# EAGLE design LPRD Sensors 1.4 (EAGLE 8.6.0)

## Sheet 1 of 2: Main This sheet contains the Arduino Mega pin layout and status LEDs. A list of the pins used on the Arduino for programmer's reference: Accelerometer: D20 (SDA), D21 (SCL) Thermocouple 1: D28 (THERMO1_LED), D22 (MAXCS1) Thermocouple 2: D30 (THERMO2_LED), D33 (MAXCS2) Thermocouple 3: D32 (THERMO3_LED), D31 (MAXCS3) All Thermocouples: D24 (MAXDO), D52 (MAXCLK) Load Cell: D34 (FORCE_LED), D2 (FORCE_DAT), D26 (FORCE_CLK) Pressure 1: D36 (PRESSURE1_LED), A2 (VOUT_PRESSURE_1) Pressure 2: D50 (PRESSURE2_LED), A3 (VOUT_PRESSURE_2) Analog Temp Sensor 1: D46 (TEMP1_LED), A4 (VOUT_TEMPERATURE_1) Analog Temp Sensor 2: D48 (TEMP2_LED), A5 (VOUT_TEMPERATURE_2) LEDs: D42 (STATE_LED), D44 (STATUS_LED)
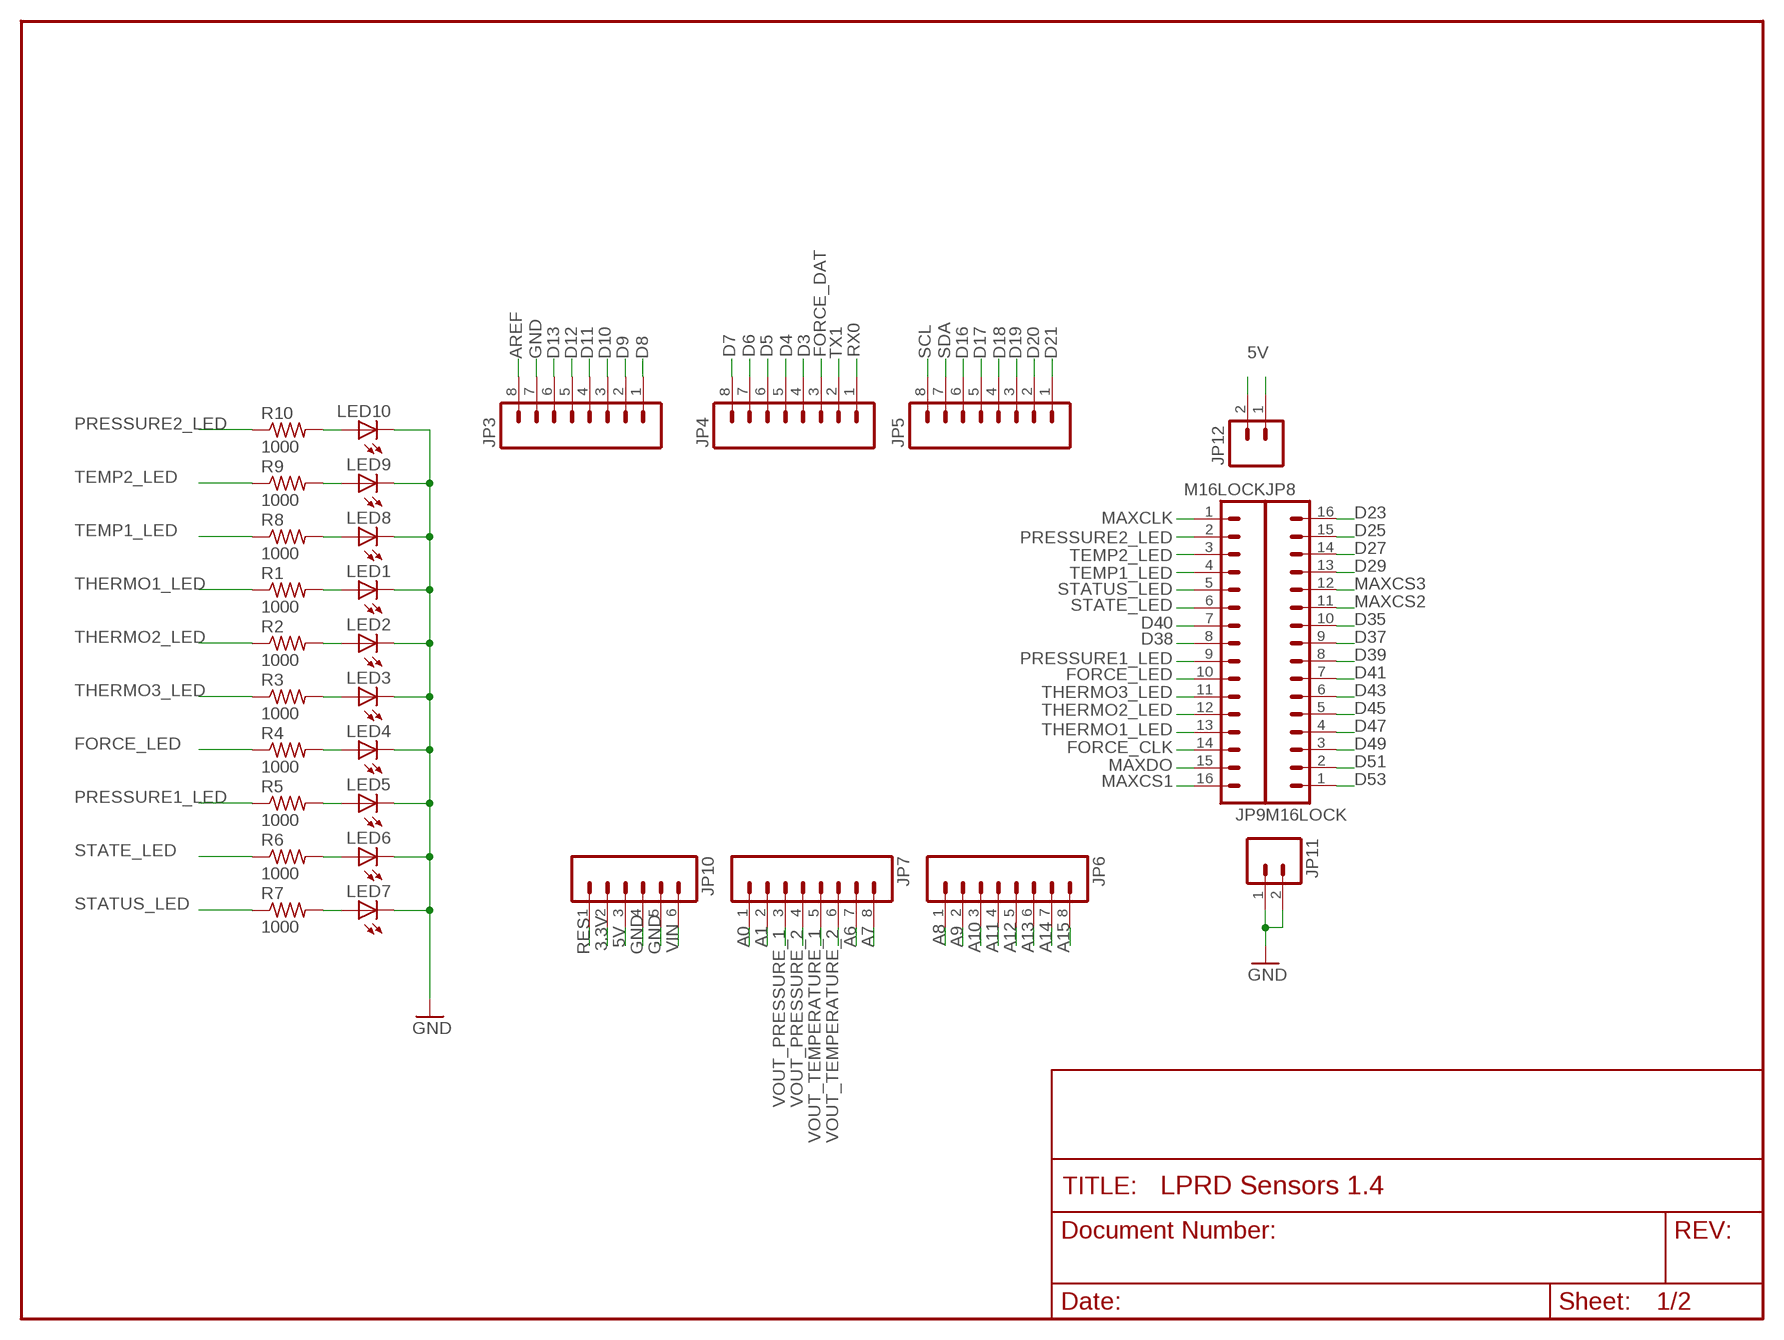
[diagram p0: schematic, sheet 1]

### Parts
JP3  M08LOCK  [1X08_LOCK]
JP4  M08LOCK  [1X08_LOCK]
JP5  M08LOCK  [1X08_LOCK]
JP6  M08LOCK  [1X08_LOCK]
JP7  M08LOCK  [1X08_LOCK]
JP8  M16LOCK  [1X16_LOCK]
JP9  M16LOCK  [1X16_LOCK]
JP10  M06LOCK  [1X06_LOCK]
JP11  M02LOCK  [1X02_LOCK]
JP12  M02LOCK  [1X02_LOCK]
LED1  LEDCHIP-LED0805  [CHIP-LED0805]
LED2  LEDCHIP-LED0805  [CHIP-LED0805]
LED3  LEDCHIP-LED0805  [CHIP-LED0805]
LED4  LEDCHIP-LED0805  [CHIP-LED0805]
LED5  LEDCHIP-LED0805  [CHIP-LED0805]
LED6  LEDCHIP-LED0805  [CHIP-LED0805]
LED7  LEDCHIP-LED0805  [CHIP-LED0805]
LED8  LEDCHIP-LED0805  [CHIP-LED0805]
LED9  LEDCHIP-LED0805  [CHIP-LED0805]
LED10  LEDCHIP-LED0805  [CHIP-LED0805]
R1  1000  R-US_R0805  [R0805]
R2  1000  R-US_R0805  [R0805]
R3  1000  R-US_R0805  [R0805]
R4  1000  R-US_R0805  [R0805]
R5  1000  R-US_R0805  [R0805]
R6  1000  R-US_R0805  [R0805]
R7  1000  R-US_R0805  [R0805]
R8  1000  R-US_R0805  [R0805]
R9  1000  R-US_R0805  [R0805]
R10  1000  R-US_R0805  [R0805]

### Nets
3.3V: JP10.2 ; also sheet 2
5V: JP10.3 JP12.1 JP12.2 ; also sheet 2
A0: JP7.1
A1: JP7.2
A6: JP7.7
A7: JP7.8
A8: JP6.1
A9: JP6.2
A10: JP6.3
A11: JP6.4
A12: JP6.5
A13: JP6.6
A14: JP6.7
A15: JP6.8
AREF: JP3.8
D3: JP4.4
D4: JP4.5
D5: JP4.6
D6: JP4.7
D7: JP4.8
D8: JP3.1
D9: JP3.2
D10: JP3.3
D11: JP3.4
D12: JP3.5
D13: JP3.6
D16: JP5.6
D17: JP5.5
D18: JP5.4
D19: JP5.3
D20: JP5.2
D21: JP5.1
D23: JP8.16
D25: JP8.15
D27: JP8.14
D29: JP8.13
D35: JP8.10
D37: JP8.9
D38: JP9.8
D39: JP8.8
D40: JP9.7
D41: JP8.7
D43: JP8.6
D45: JP8.5
D47: JP8.4
D49: JP8.3
D51: JP8.2
D53: JP8.1
FORCE_CLK: JP9.14 ; also sheet 2
FORCE_DAT: JP4.3 ; also sheet 2
FORCE_LED: JP9.10 R4.1
GND: JP3.7 JP10.4 JP10.5 JP11.1 JP11.2 LED1.C LED2.C LED3.C LED4.C LED5.C LED6.C LED7.C LED8.C LED9.C LED10.C ; also sheet 2
MAXCLK: JP9.1 ; also sheet 2
MAXCS1: JP9.16 ; also sheet 2
MAXCS2: JP8.11 ; also sheet 2
MAXCS3: JP8.12 ; also sheet 2
MAXDO: JP9.15 ; also sheet 2
N$1: LED1.A R1.2
N$2: LED2.A R2.2
N$3: LED3.A R3.2
N$4: LED4.A R4.2
N$5: LED5.A R5.2
N$6: LED6.A R6.2
N$7: LED7.A R7.2
N$15: LED8.A R8.2
N$16: LED9.A R9.2
N$23: LED10.A R10.2
PRESSURE1_LED: JP9.9 R5.1
PRESSURE2_LED: JP9.2 R10.1
RES: JP10.1
RX0: JP4.1
SCL: JP5.8 ; also sheet 2
SDA: JP5.7 ; also sheet 2
STATE_LED: JP9.6 R6.1
STATUS_LED: JP9.5 R7.1
TEMP1_LED: JP9.4 R8.1
TEMP2_LED: JP9.3 R9.1
THERMO1_LED: JP9.13 R1.1
THERMO2_LED: JP9.12 R2.1
THERMO3_LED: JP9.11 R3.1
TX1: JP4.2
VIN: JP10.6
VOUT_PRESSURE_1: JP7.3 ; also sheet 2
VOUT_PRESSURE_2: JP7.4 ; also sheet 2
VOUT_TEMPERATURE_1: JP7.5 ; also sheet 2
VOUT_TEMPERATURE_2: JP7.6 ; also sheet 2

## Sheet 2 of 2: Sensors This sheet contains the following sensor elements J1: MMA8451 accelerometer female 8-pin connector J5 & J11: PS-AN2 ASIC pressure sensor 3-pin screw connector J3 & J4: HX711 load cell 5-pin female connector J10: 4-pin screw connector for load cell wires J7, J8 & J9: K-Type Thermocouple 2-pin screw connector IC1, IC2 & IC3: MAX31855 thermocouple amplifier surface mounts J2: LM35DXB temperature sensor 4 pin connector
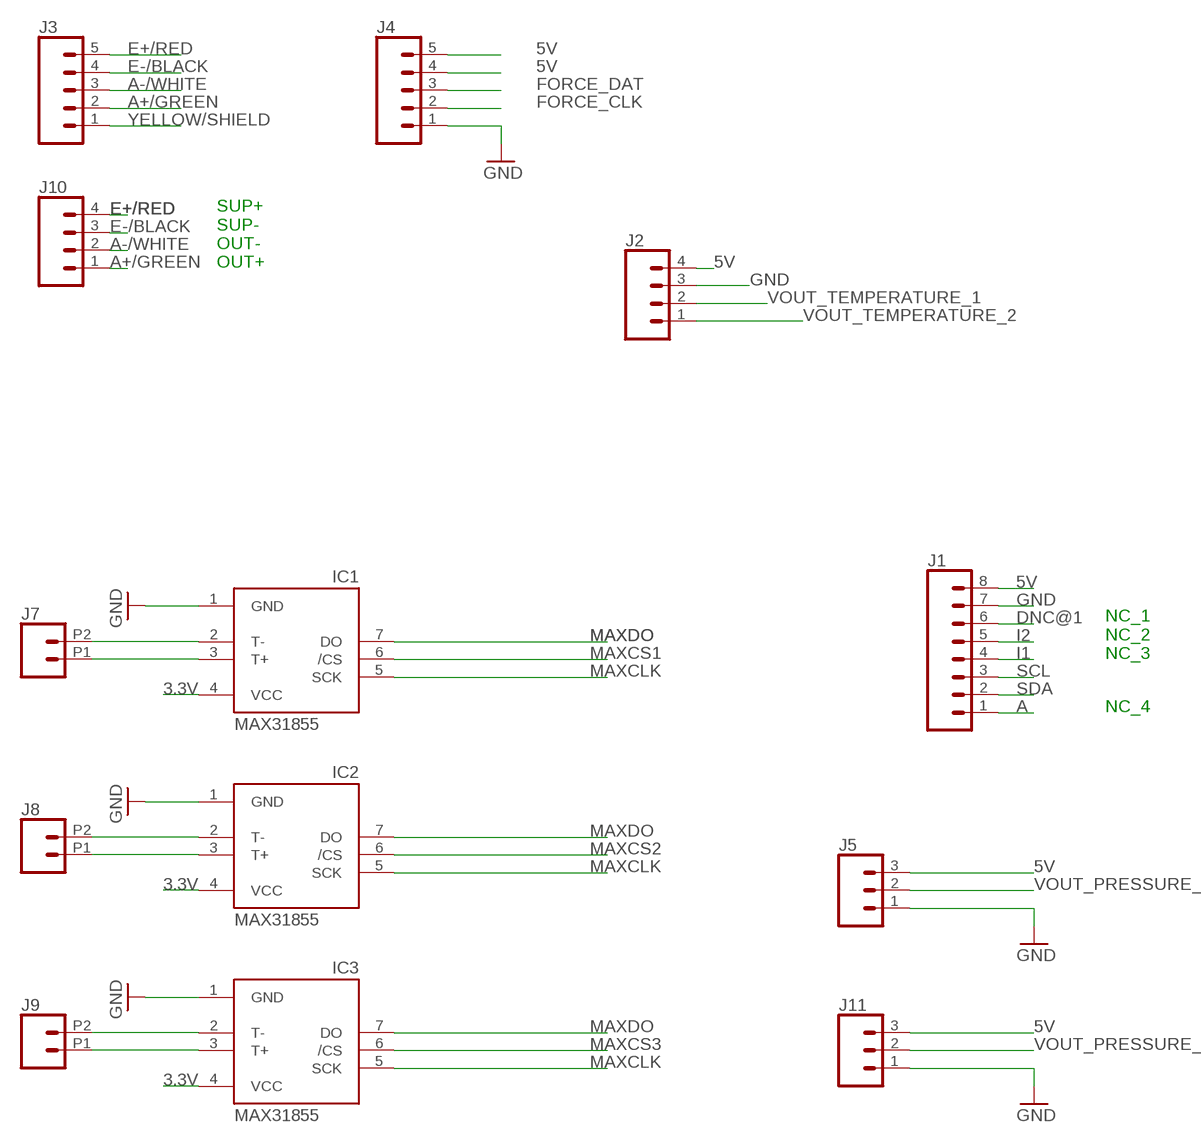
[diagram p1: schematic, sheet 2]

### Parts
IC1  MAX31855  MAX6675  [SO08]
IC2  MAX31855  MAX6675  [SO08]
IC3  MAX31855  MAX6675  [SO08]
J1  CONN_08"  [1X08]
J2  CONN_04  [1X04]
J3  CONN_05  [1X05]
J4  CONN_05  [1X05]
J5  CONN_03-SCREW-5MM  [SCREWTERMINAL-5MM-3]
J7  CONN_022.54MM_SCREWTERM  [1X02_2.54_SCREWTERM]
J8  CONN_022.54MM_SCREWTERM  [1X02_2.54_SCREWTERM]
J9  CONN_022.54MM_SCREWTERM  [1X02_2.54_SCREWTERM]
J10  CONN_04SCREW  [SCREWTERMINAL-3.5MM-4]
J11  CONN_03-SCREW-5MM  [SCREWTERMINAL-5MM-3]

### Nets
3.3V: IC1.4(VCC) IC2.4(VCC) IC3.4(VCC) ; also sheet 1
5V: J1.8 J2.4 J4.4 J4.5 J5.3 J11.3 ; also sheet 1
A: J1.1
A+/GREEN: J3.2 J10.1
A-/WHITE: J3.3 J10.2
DNC@1: J1.6
E+/RED: J3.5 J10.4
E-/BLACK: J3.4 J10.3
FORCE_CLK: J4.2 ; also sheet 1
FORCE_DAT: J4.3 ; also sheet 1
GND: IC1.1(GND) IC2.1(GND) IC3.1(GND) J1.7 J2.3 J4.1 J5.1 J11.1 ; also sheet 1
I1: J1.4
I2: J1.5
MAXCLK: IC1.5(SCK) IC2.5(SCK) IC3.5(SCK) ; also sheet 1
MAXCS1: IC1.6(/CS) ; also sheet 1
MAXCS2: IC2.6(/CS) ; also sheet 1
MAXCS3: IC3.6(/CS) ; also sheet 1
MAXDO: IC1.7(DO) IC2.7(DO) IC3.7(DO) ; also sheet 1
N$8: IC1.2(T-) J7.P2
N$10: IC1.3(T+) J7.P1
N$11: IC2.2(T-) J8.P2
N$12: IC2.3(T+) J8.P1
N$13: IC3.2(T-) J9.P2
N$14: IC3.3(T+) J9.P1
SCL: J1.3 ; also sheet 1
SDA: J1.2 ; also sheet 1
VOUT_PRESSURE_1: J5.2 ; also sheet 1
VOUT_PRESSURE_2: J11.2 ; also sheet 1
VOUT_TEMPERATURE_1: J2.2 ; also sheet 1
VOUT_TEMPERATURE_2: J2.1 ; also sheet 1
YELLOW/SHIELD: J3.1

### Notes on the sheet
- SUP+
  SUP-
  OUT-
  OUT+
- NC_1
  NC_2
  NC_3
- NC_4

## Library data of the parts
IC1-IC3 = adafruit:MAX6675
J1 = SparkFun-Connectors:CONN_08: Multi connection point. Often used as Generic Header-pin footprint for 0.1 inch spaced/style header connections On any of the 0.1 inch spaced packages, you can populate with these: Break Away Headers - Straight <https://www.sparkfun.com/products/116> (PRT-00116) Break Away Male Headers - Right Angle <https://www.sparkfun.com/products/553> (PRT-00553) Female Headers <https://www.sparkfun.com/products/115> (PRT-00115) Break Away Headers - Machine Pin <https://www.sparkfun.com/products/117> (PRT-00117) Break Away Female Headers - Swiss Machine Pin <https://www.sparkfun.com/products/743> (PRT-00743) Arduino Stackable Header - 8 Pin <https://www.sparkfun.com/products/9279> (PRT-09279) For SCREWTERMINALS and SPRING TERMINALS visit here: Screw Terimnals on SparkFun.com <https://www.sparkfun.com/search/results?term=Screw+Terminals> (5mm/3.5mm/2.54mm spacing) This device is also useful as a general connection point to wire up your design to another part of your project. Our various solder wires solder well into these plated through hole pads. Hook-Up Wire - Assortment (Stranded, 22 AWG) <https://www.sparkfun.com/products/11375> (PRT-11375) Hook-Up Wire - Assortment (Solid Core, 22 AWG) <https://www.sparkfun.com/products/11367> (PRT-11367) View the entire wire category on our website here <https://www.sparkfun.com/categories/141> Special notes: Molex polarized connector foot print use with SKU : PRT-08231 with associated crimp pins and housings. 1MM SMD Version SKU: PRT-10208 NOTES ON THE VARIANTS LOCK and LOCK_LONGPADS... This footprint was designed to help hold the alignment of a through-hole component (i.e. 6-pin header) while soldering it into place. You may notice that each hole has been shifted either up or down by 0.005 of an inch from it's more standard position (which is a perfectly straight line). This slight alteration caused the pins (the squares in the middle) to touch the edges of the holes. Because they are alternating, it causes a "brace" to hold the component in place. 0.005 has proven to be the perfect amount of "off-center" position when using our standard breakaway headers. Although looks a little odd when you look at the bare footprint, once you have a header in there, the alteration is very hard to notice. Also,if you push a header all the way into place, it is covered up entirely on the bottom side.; PROD_ID: CONN-08438
J2 = SparkFun-Connectors:CONN_04: Multi connection point. Often used as Generic Header-pin footprint for 0.1 inch spaced/style header connections On any of the 0.1 inch spaced packages, you can populate with these: Break Away Headers - Straight <https://www.sparkfun.com/products/116> (PRT-00116) Break Away Male Headers - Right Angle <https://www.sparkfun.com/products/553> (PRT-00553) Female Headers <https://www.sparkfun.com/products/115> (PRT-00115) Break Away Headers - Machine Pin <https://www.sparkfun.com/products/117> (PRT-00117) Break Away Female Headers - Swiss Machine Pin <https://www.sparkfun.com/products/743> (PRT-00743) For SCREWTERMINALS and SPRING TERMINALS visit here: Screw Terimnals on SparkFun.com <https://www.sparkfun.com/search/results?term=Screw+Terminals> (5mm/3.5mm/2.54mm spacing) This device is also useful as a general connection point to wire up your design to another part of your project. Our various solder wires solder well into these plated through hole pads. Hook-Up Wire - Assortment (Stranded, 22 AWG) <https://www.sparkfun.com/products/11375> (PRT-11375) Hook-Up Wire - Assortment (Solid Core, 22 AWG) <https://www.sparkfun.com/products/11367> (PRT-11367) View the entire wire category on our website here <https://www.sparkfun.com/categories/141> Special notes: Molex polarized connector foot print use with SKU : PRT-08231 with associated crimp pins and housings. 1MM SMD Version SKU: PRT-10208; PROD_ID: CONN-09696
J3 J4 = SparkFun-Connectors:CONN_05: Multi connection point. Often used as Generic Header-pin footprint for 0.1 inch spaced/style header connections On any of the 0.1 inch spaced packages, you can populate with these: Break Away Headers - Straight <https://www.sparkfun.com/products/116> (PRT-00116) Break Away Male Headers - Right Angle <https://www.sparkfun.com/products/553> (PRT-00553) Female Headers <https://www.sparkfun.com/products/115> (PRT-00115) Break Away Headers - Machine Pin <https://www.sparkfun.com/products/117> (PRT-00117) Break Away Female Headers - Swiss Machine Pin <https://www.sparkfun.com/products/743> (PRT-00743) For SCREWTERMINALS and SPRING TERMINALS visit here: Screw Terimnals on SparkFun.com <https://www.sparkfun.com/search/results?term=Screw+Terminals> (5mm/3.5mm/2.54mm spacing) This device is also useful as a general connection point to wire up your design to another part of your project. Our various solder wires solder well into these plated through hole pads. Hook-Up Wire - Assortment (Stranded, 22 AWG) <https://www.sparkfun.com/products/11375> (PRT-11375) Hook-Up Wire - Assortment (Solid Core, 22 AWG) <https://www.sparkfun.com/products/11367> (PRT-11367) View the entire wire category on our website here <https://www.sparkfun.com/categories/141> Special notes: Molex polarized connector foot print use with SKU : PRT-08231 with associated crimp pins and housings. 1MM SMD Version SKU: PRT-10208
J5 J11 = SparkFun-Connectors:CONN_03: Multi connection point. Often used as Generic Header-pin footprint for 0.1 inch spaced/style header connections On any of the 0.1 inch spaced packages, you can populate with these: Break Away Headers - Straight <https://www.sparkfun.com/products/116> (PRT-00116) Break Away Male Headers - Right Angle <https://www.sparkfun.com/products/553> (PRT-00553) Female Headers <https://www.sparkfun.com/products/115> (PRT-00115) Break Away Headers - Machine Pin <https://www.sparkfun.com/products/117> (PRT-00117) Break Away Female Headers - Swiss Machine Pin <https://www.sparkfun.com/products/743> (PRT-00743) Stackable Header - 3 Pin (Female, 0.1") <https://www.sparkfun.com/products/13875> (PRT-13875) For SCREWTERMINALS and SPRING TERMINALS visit here: Screw Terimnals on SparkFun.com <https://www.sparkfun.com/search/results?term=Screw+Terminals> (5mm/3.5mm/2.54mm spacing) This device is also useful as a general connection point to wire up your design to another part of your project. Our various solder wires solder well into these plated through hole pads. Hook-Up Wire - Assortment (Stranded, 22 AWG) <https://www.sparkfun.com/products/11375> (PRT-11375) Hook-Up Wire - Assortment (Solid Core, 22 AWG) <https://www.sparkfun.com/products/11367> (PRT-11367) View the entire wire category on our website here <https://www.sparkfun.com/categories/141> Special notes: Molex polarized connector foot print use with SKU : PRT-08232 with associated crimp pins and housings.; PROD_ID: CONN-10134; SF_SKU: PRT-08433
J7-J9 = SparkFun-Connectors:CONN_02: Multi connection point. Often used as Generic Header-pin footprint for 0.1 inch spaced/style header connections On any of the 0.1 inch spaced packages, you can populate with these: Break Away Headers - Straight <https://www.sparkfun.com/products/116> (PRT-00116) Break Away Male Headers - Right Angle <https://www.sparkfun.com/products/553> (PRT-00553) Female Headers <https://www.sparkfun.com/products/115> (PRT-00115) Break Away Headers - Machine Pin <https://www.sparkfun.com/products/117> (PRT-00117) Break Away Female Headers - Swiss Machine Pin <https://www.sparkfun.com/products/743> (PRT-00743) For SCREWTERMINALS and SPRING TERMINALS visit here: Screw Terimnals on SparkFun.com <https://www.sparkfun.com/search/results?term=Screw+Terminals> (5mm/3.5mm/2.54mm spacing) This device is also useful as a general connection point to wire up your design to another part of your project. Our various solder wires solder well into these plated through hole pads. Hook-Up Wire - Assortment (Stranded, 22 AWG) <https://www.sparkfun.com/products/11375> (PRT-11375) Hook-Up Wire - Assortment (Solid Core, 22 AWG) <https://www.sparkfun.com/products/11367> (PRT-11367) View the entire wire category on our website here <https://www.sparkfun.com/categories/141> Special notes: Molex polarized connector foot print use with: PRT-08233 with associated crimp pins and housings. 2.54_SCREWTERM for use with PRT-10571. 3.5mm Screw Terminal footprints for PRT-08084 5mm Screw Terminal footprints for use with PRT-08432
J10 = SparkFun-Connectors:CONN_04: Multi connection point. Often used as Generic Header-pin footprint for 0.1 inch spaced/style header connections On any of the 0.1 inch spaced packages, you can populate with these: Break Away Headers - Straight <https://www.sparkfun.com/products/116> (PRT-00116) Break Away Male Headers - Right Angle <https://www.sparkfun.com/products/553> (PRT-00553) Female Headers <https://www.sparkfun.com/products/115> (PRT-00115) Break Away Headers - Machine Pin <https://www.sparkfun.com/products/117> (PRT-00117) Break Away Female Headers - Swiss Machine Pin <https://www.sparkfun.com/products/743> (PRT-00743) For SCREWTERMINALS and SPRING TERMINALS visit here: Screw Terimnals on SparkFun.com <https://www.sparkfun.com/search/results?term=Screw+Terminals> (5mm/3.5mm/2.54mm spacing) This device is also useful as a general connection point to wire up your design to another part of your project. Our various solder wires solder well into these plated through hole pads. Hook-Up Wire - Assortment (Stranded, 22 AWG) <https://www.sparkfun.com/products/11375> (PRT-11375) Hook-Up Wire - Assortment (Solid Core, 22 AWG) <https://www.sparkfun.com/products/11367> (PRT-11367) View the entire wire category on our website here <https://www.sparkfun.com/categories/141> Special notes: Molex polarized connector foot print use with SKU : PRT-08231 with associated crimp pins and housings. 1MM SMD Version SKU: PRT-10208; PROD_ID: 2xCONN-08399; SF_ID: 2xPRT-08084
JP3-JP7 = SparkFun:M08: Header 8 Standard 8-pin 0.1" header. Use with straight break away headers (SKU : PRT-00116), right angle break away headers (PRT-00553), swiss pins (PRT-00743), machine pins (PRT-00117), and female headers (PRT-00115).
JP8 JP9 = SparkFun:M16
JP10 = SparkFun:M06: Header 6 Standard 6-pin 0.1" header. Use with straight break away headers (SKU : PRT-00116), right angle break away headers (PRT-00553), swiss pins (PRT-00743), machine pins (PRT-00117), and female headers (PRT-00115). Molex polarized connector foot print use with SKU : PRT-08094 with associated crimp pins and housings. NOTES ON THE VARIANTS LOCK and LOCK_LONGPADS... This footprint was designed to help hold the alignment of a through-hole component (i.e. 6-pin header) while soldering it into place. You may notice that each hole has been shifted either up or down by 0.005 of an inch from it's more standard position (which is a perfectly straight line). This slight alteration caused the pins (the squares in the middle) to touch the edges of the holes. Because they are alternating, it causes a "brace" to hold the component in place. 0.005 has proven to be the perfect amount of "off-center" position when using our standard breakaway headers. Although looks a little odd when you look at the bare footprint, once you have a header in there, the alteration is very hard to notice. Also, if you push a header all the way into place, it is covered up entirely on the bottom side. This idea of altering the position of holes to aid alignment will be further integrated into the Sparkfun Library for other footprints. It can help hold any component with 3 or more connection pins.
JP11 JP12 = SparkFun:M02: Header 2 Standard 2-pin 0.1" header. Use with straight break away headers (SKU : PRT-00116), right angle break away headers (PRT-00553), swiss pins (PRT-00743), machine pins (PRT-00117), and female headers (PRT-00115). Molex polarized connector foot print use with SKU : PRT-08233 with associated crimp pins and housings.
LED1-LED10 = adafruit:LED: LED OSRAM: - CHIPLED LG R971, LG N971, LY N971, LG Q971, LY Q971, LO R971, LY R971 LH N974, LH R974 LS Q976, LO Q976, LY Q976 LO Q996 - Hyper CHIPLED LW Q18S LB Q993, LB Q99A, LB R99A - SideLED LS A670, LO A670, LY A670, LG A670, LP A670 LB A673, LV A673, LT A673, LW A673 LH A674 LY A675 LS A676, LA A676, LO A676, LY A676, LW A676 LS A679, LY A679, LG A679 - Hyper Micro SIDELED® LS Y876, LA Y876, LO Y876, LY Y876 LT Y87S - SmartLED LW L88C, LW L88S LB L89C, LB L89S, LG L890 LS L89K, LO L89K, LY L89K LS L896, LA L896, LO L896, LY L896 - TOPLED LS T670, LO T670, LY T670, LG T670, LP T670 LSG T670, LSP T670, LSY T670, LOP T670, LYG T670 LG T671, LOG T671, LSG T671 LB T673, LV T673, LT T673, LW T673 LH T674 LS T676, LA T676, LO T676, LY T676, LB T676, LH T676, LSB T676, LW T676 LB T67C, LV T67C, LT T67C, LS T67K, LO T67K, LY T67K, LW E67C LS E67B, LA E67B, LO E67B, LY E67B, LB E67C, LV E67C, LT E67C LW T67C LS T679, LY T679, LG T679 LS T770, LO T770, LY T770, LG T770, LP T770 LB T773, LV T773, LT T773, LW T773 LH T774 LS E675, LA E675, LY E675, LS T675 LS T776, LA T776, LO T776, LY T776, LB T776 LHGB T686 LT T68C, LB T68C - Hyper Mini TOPLED® LB M676 - Mini TOPLED Santana® LG M470 LS M47K, LO M47K, LY M47K Source: http://www.osram.convergy.de/
R1-R10 = resistor:R-US_: RESISTOR, American symbol

## Board
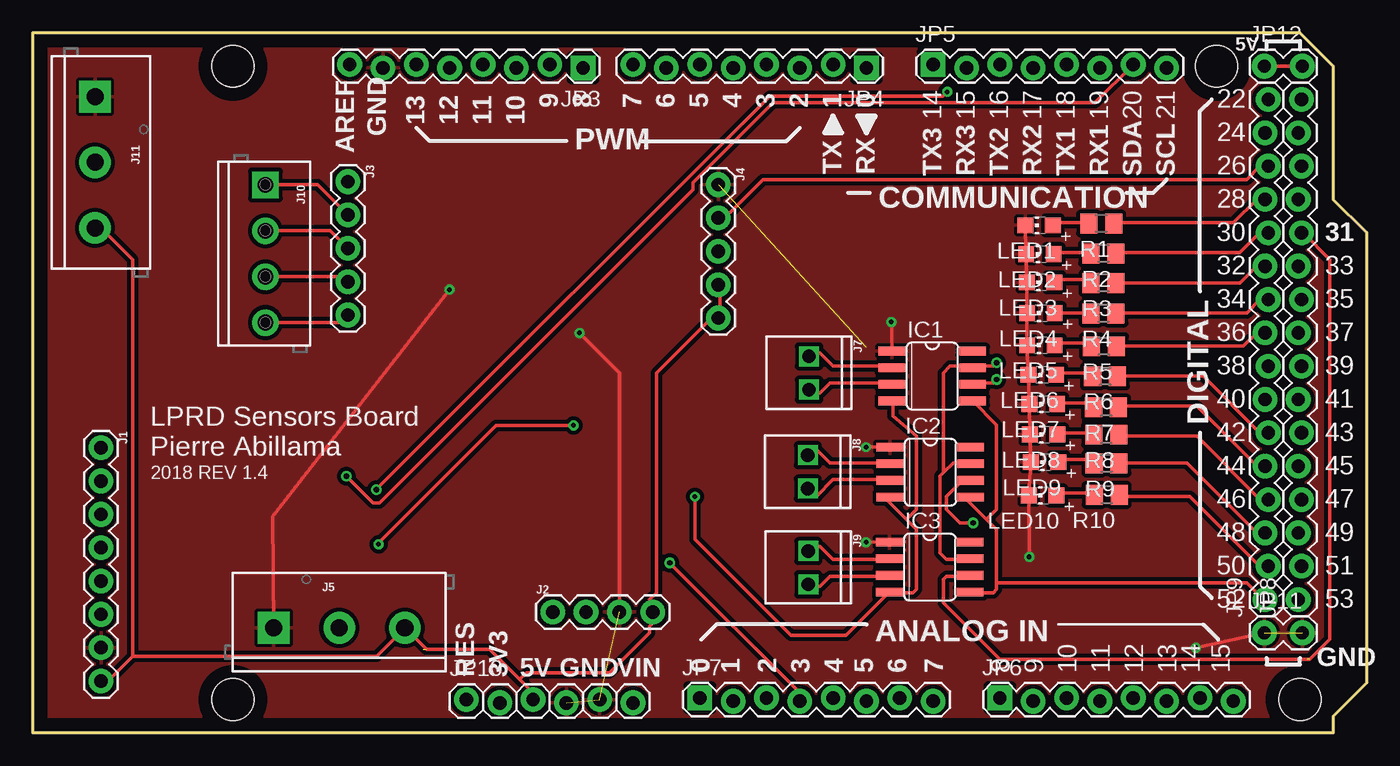
[diagram p2: board, top side]
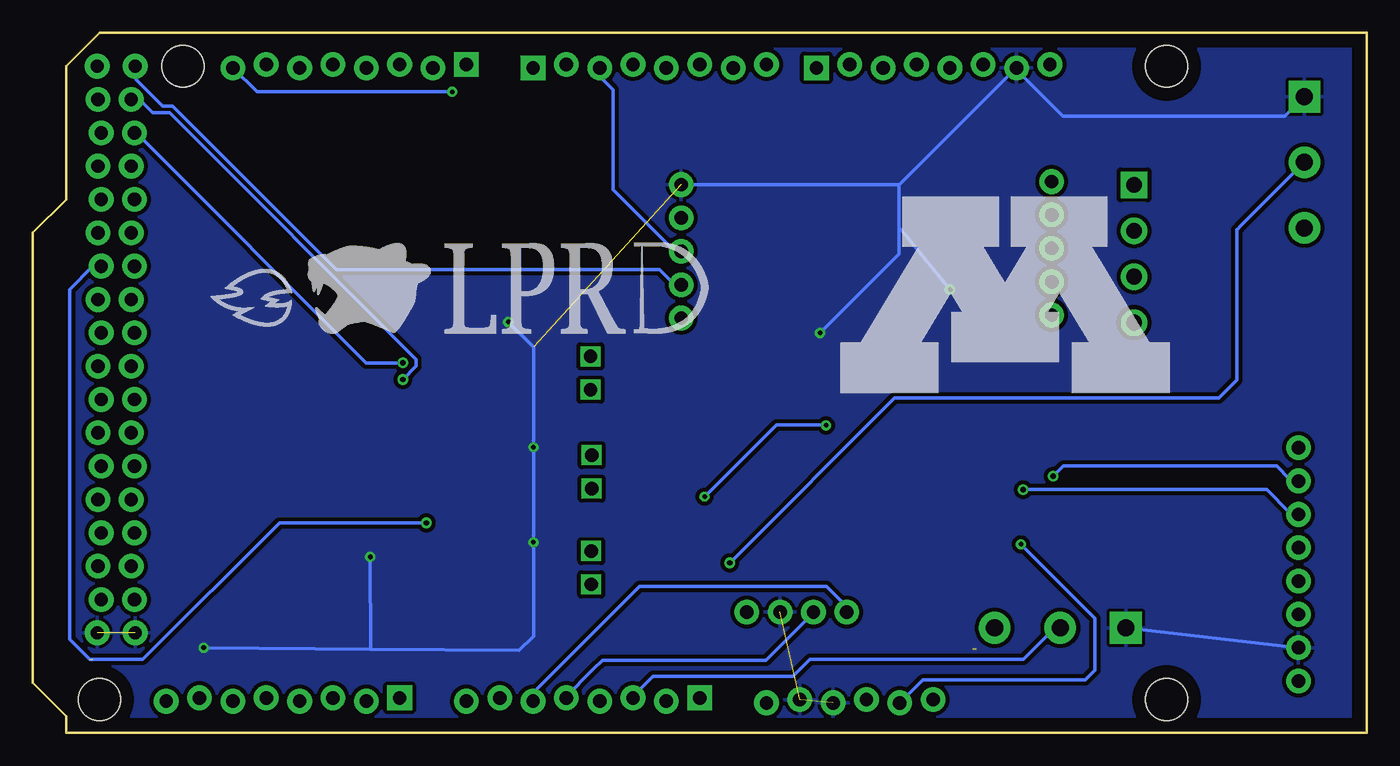
[diagram p3: board, bottom side, seen from below]

Size 101.6 x 53.34 mm. Coordinates in mm from the lower left corner, seen from the top.
Outline: 0,0 99.06,0 99.06,1.27 101.6,3.81 101.6,38.1 99.06,40.64 99.06,50.8 96.52,53.34 0,53.34 0,0
Copper layers (1*16): Top 0.035mm / dielectric 1.5mm / Bottom 0.035mm
Design rules "othermillpro": minimum track width 10mil, minimum drill 16mil, track to track 10mil, track to pad 10mil, pad to pad 10mil, via to via 10mil, smd to smd 6mil, copper to edge 40mil, drill to drill 6mil, minimum pad ring 10mil, minimum via ring 8mil, stop-mask expansion 4mil, vias tented up to drill 0mil, thermal gap 10mil
Holes 3.2 mm at 15.24,50.8 15.24,2.54 90.17,50.8 96.52,2.54

### Footprints (pad centres in the part's own frame; a part is rotated, then mirrored left to right if it is on the bottom)
SO08 = smd 0.66 x 2.032: 1 -1.905,-3.073; 2 -0.635,-3.073; 3 0.635,-3.073; 4 1.905,-3.073; 5 1.905,3.073; 6 0.635,3.073; 7 -0.635,3.073; 8 -1.905,3.073
1X08 = drill 1.016 pad 1.88: 1 0,0; 2 2.54,0; 3 5.08,0; 4 7.62,0; 5 10.16,0; 6 12.7,0; 7 15.24,0; 8 17.78,0
1X04 = drill 1.016 pad 1.88: 1 0,0; 2 2.54,0; 3 5.08,0; 4 7.62,0
1X05 = drill 1.016 pad 1.88: 1 0,0; 2 2.54,0; 3 5.08,0; 4 7.62,0; 5 10.16,0
SCREWTERMINAL-5MM-3 = drill 1.3 pad 2.413 square: 1 0,0 | drill 1.3 pad 2.413: 2 5,0; 3 10,0
1X02_2.54_SCREWTERM = drill 1.016 square: P1 2.54,0; P2 0,0
SCREWTERMINAL-3.5MM-4 = drill 1.2 pad 2.032 square: 1 0,0 | drill 1.2 pad 2.032: 2 3.5,0; 3 7,0; 4 10.5,0
1X08_LOCK = drill 1.016 pad 1.88 square: 1 0,0.127 | drill 1.016 pad 1.88: 2 2.54,-0.127; 3 5.08,0.127; 4 7.62,-0.127; 5 10.16,0.127; 6 12.7,-0.127; 7 15.24,0.127; 8 17.78,-0.127
1X16_LOCK = drill 1.016 pad 1.88: 1 0,0.127; 2 2.54,-0.127; 3 5.08,0.127; 4 7.62,-0.127; 5 10.16,0.127; 6 12.7,-0.127; 7 15.24,0.127; 8 17.78,-0.127; 9 20.32,0.127; 10 22.86,-0.127; 11 25.4,0.127; 12 27.94,-0.127; 13 30.48,0.127; 14 33.02,-0.127; 15 35.56,0.127; 16 38.1,-0.127
1X06_LOCK = drill 1.016 pad 1.88: 1 0,0; 2 2.54,-0.254; 3 5.08,0; 4 7.62,-0.254; 5 10.16,0; 6 12.7,-0.254
1X02_LOCK = drill 1.016 pad 1.88: 1 -0.178,0; 2 2.718,0
CHIP-LED0805 = smd 1.2 x 1.2: A 0,-1.05; C 0,1.05
R0805 = smd 1.3 x 1.5: 1 -0.95,0; 2 0.95,0

### Placement (x,y rotation side)
IC1  68.52,27.19 270 top
IC2  68.36,19.86 270 top
IC3  68.33,12.64 270 top
J1  5.19,21.73 270 top
J2  39.6,9.21 0 top
J3  24,42 270 top
J4  52.21,41.77 270 top
J5  18.34,8 0 top
J7  59.12,28.69 270 top
J8  59.03,21.16 270 top
J9  59.07,13.86 270 top
J10  17.72,41.76 270 top
J11  4.74,48.48 270 top
JP3  41.91,50.8 180 top
JP4  63.5,50.8 180 top
JP5  68.58,50.8 0 top
JP6  73.66,2.54 0 top
JP7  50.8,2.54 0 top
JP8  96.52,10.16 90 top
JP9  93.98,10.16 90 top
JP10  33.02,2.54 0 top
JP11  93.98,7.62 0 top
JP12  93.98,50.8 0 top
LED1  76.64,38.67 90 top
LED2  76.71,36.47 90 top
LED3  76.76,34.33 90 top
LED4  76.78,31.98 90 top
LED5  76.78,29.54 90 top
LED6  76.89,27.28 90 top
LED7  76.96,25.06 90 top
LED8  76.99,22.73 90 top
LED9  77.06,20.62 90 top
LED10  76.91,18.08 90 top
R1  81.38,38.8 180 top
R2  81.53,36.51 180 top
R3  81.55,34.28 180 top
R4  81.55,31.95 180 top
R5  81.58,29.45 180 top
R6  81.67,27.18 180 top
R7  81.75,24.8 180 top
R8  81.76,22.71 180 top
R9  81.79,20.52 180 top
R10  81.8,18.14 180 top
U$1  [UMNLOGO]  14.86,25.82 0 top
U$2  [LPRDLOGO]  49.11,27.13 0 top

### Tracks (layer width: path | path; a pad name or v marks a point on that pad's centre or on a via)
3.3V  (via drill 0.35)
  Top 0.254: 66.55,16.26 65.02,17.78 65.28,18.03 IC2.4 | 66.55,16.26 67.31,15.49 67.31,10.92 67.06,10.67 65.28,10.67 IC3.4 61.95,7.43 57.75,7.43 50.44,14.73 50.44,17.44 50.44,17.98 v50.43,18 | 66.55,16.26 67.31,17.02 67.31,22.61 65.53,24.13 65.53,25.15 IC1.4 | v41.17,23.43 35.28,23.43 26.38,14.53 26.38,14.43 v26.33,14.38
  Bottom 0.254: v50.43,18 44.96,23.47 42.43,23.47 42.27,23.47 41.21,23.47 v41.17,23.43 | v26.33,14.38 20.69,8.74 20.69,4.78 21.41,4.05 33.8,4.05 JP10.2
5V  (1 unrouted)
  Top 0.254: JP12.2 JP12.1 | J4.4 52.32,34.04 52.32,31.75 J4.5 52.07,31.5 51.56,31.5 47.5,27.43 47.5,10.67 46.99,10.16 46.99,9.4 J2.4 47.24,9.14 47.24,8.38 46.99,8.13 46.99,7.62 43.94,4.57 37.59,4.57 37.08,4.06 | 7.62,5.84 5.84,4.06 5.33,4.06 J1.8 | 7.62,5.84 26.18,5.84 J5.3 29.99,6.35 34.8,6.35 37.08,4.06 | JP10.3 38.1,3.05 37.08,4.06 | 7.62,5.84 7.62,36.07 5.33,38.35 4.83,38.35 J11.3
  Bottom 0.254: JP12.1 93.73,50.8 93.73,49.78 91.69,47.75 90.93,47.75 78.49,35.31 53.85,35.31 52.83,34.29 52.32,34.29 J4.4
A+/GREEN
  Top 0.254: J10.1 21.7,41.76 J3.2
A-/WHITE
  Top 0.254: J10.2 22.66,38.26 J3.3
D21
  Top 0.254: 68.58,51.05 JP5.1
E+/RED
  Top 0.254: J10.4 23.42,31.26 J3.5
E-/BLACK
  Top 0.254: J10.3 23.62,34.76 J3.4
FORCE_CLK
  Top 0.254: JP9.14 93.47,43.18 92.46,42.16 55.63,42.16 52.83,39.37 52.32,39.37 J4.2
FORCE_DAT
  Bottom 0.254: JP4.3 58.42,50.04 57.4,49.02 57.4,41.4 52.83,36.83 52.32,36.83 J4.3
FORCE_LED
  Top 0.254: JP9.10 93.47,33.02 92.46,32 82.55,32 R4.1
GND  (via drill 0.35)  (4 unrouted)
  Top 0.254: IC1.1 65.44,31.22 65.51,31.28 65.43,31.28 v65.39,31.32 | v88.58,6.49 JP11.1 | J2.3 44.68,27.43 v41.63,30.48 | IC2.1 v63.48,21.77 | IC3.1 v63.48,14.53 | LED1.C LED2.C LED3.C LED4.C LED5.C LED6.C LED7.C LED8.C LED9.C LED10.C v75.89,13.41 | J5.1 18.25,16.5 v31.74,33.77
  Bottom 0.254: J11.1 6.22,46.99 23.14,46.99 26.67,50.52 JP3.7 35.57,41.77 35.62,41.77 | 35.62,41.77 J4.1 | v65.39,31.32 63.48,29.4 v63.48,21.77 v63.48,14.53 63.48,7.37 64.57,6.27 75.87,6.38 | 75.87,6.38 v88.58,6.49 | v41.63,30.48 35.62,36.49 35.62,38.54 | 35.62,38.54 35.62,41.77 | v75.89,13.41 75.87,6.38 | J1.7 J5.1 | v31.74,33.77 35.62,38.54
  pour Bottom (isolate 0.305): 0,0 99.06,0 99.06,1.27 101.6,3.81 101.6,38.1 99.06,40.64 99.06,50.8 96.52,53.34 0,53.34
  pour Top (isolate 0.305): 0,0 99.06,0 99.06,1.27 101.6,3.81 101.6,38.1 99.06,40.64 99.06,50.8 96.52,53.34 0,53.34
MAXCLK
  Top 0.254: 73.41,11.43 73.41,15.49 72.64,16.26 | 73.41,11.43 73.41,10.92 73.15,10.67 71.63,10.67 IC3.5 | 72.64,16.26 71.12,17.78 71.37,18.03 IC2.5 | 72.64,16.26 73.41,17.02 73.41,23.47 IC1.5 71.63,25.15 | 73.41,11.43 92.46,11.43 93.73,10.16 JP9.1
MAXCS1  (via drill 0.41)
  Top 0.254: v73.41,26.92 73.15,26.67 71.63,26.67 IC1.6
  Bottom 0.254: v73.41,26.92 72.39,27.94 72.39,28.45 91.19,47.24 92.46,47.24 93.47,48.26 JP9.16
MAXCS2  (via drill 0.41)  (1 unrouted)
  Top 0.254: v71.63,16 70.61,16 69.6,17.02 69.6,18.03 70.61,19.05 71.37,19.05 IC2.6
  Bottom 0.254: v71.63,16 82.8,16 93.22,5.59 97.28,5.59 98.81,7.11 98.81,33.78 97.03,35.56 JP8.11 | 97.03,5.59 96.52,5.59
MAXCS3
  Top 0.254: IC3.6 71.37,11.94 69.6,11.94 69.34,11.68 69.34,9.91 73.66,5.59 92.32,5.59 95.25,5.59 97.28,5.59 98.81,7.11 98.81,36.07 96.77,38.1 JP8.12
MAXDO  (via drill 0.41)
  Top 0.254: 69.37,19.84 70.1,20.57 71.37,20.57 IC2.7 | 69.37,19.84 69.09,19.56 69.09,13.72 69.6,13.21 71.37,13.21 IC3.7 | v73.41,28.19 73.15,27.94 71.63,27.94 IC1.7 71.37,27.94 69.85,27.94 69.34,27.43 69.34,19.86 69.37,19.84
  Bottom 0.254: v73.41,28.19 76.2,28.19 93.73,45.72 JP9.15
N$1
  Top 0.254: LED1.A 77.72,38.86 80.26,38.86 R1.2
N$2
  Top 0.254: LED2.A 77.98,36.58 80.52,36.58 R2.2
N$3
  Top 0.254: LED3.A 77.98,34.54 80.26,34.54 80.52,34.29 R3.2
N$4
  Top 0.254: LED4.A 77.98,32 80.52,32 R4.2
N$5
  Top 0.254: LED5.A 77.98,29.72 80.26,29.72 80.52,29.46 R5.2
N$6
  Top 0.254: LED6.A 77.98,27.43 80.26,27.43 80.52,27.18 R6.2
N$7
  Top 0.254: LED7.A 78.23,25.15 80.52,25.15 80.77,24.89 R7.2
N$8
  Top 0.254: IC1.2 65.28,27.94 60.96,27.94 59.94,28.96 59.44,28.96 59.18,28.7 J7.P2
N$10
  Top 0.254: IC1.3 65.28,26.67 60.71,26.67 59.94,25.91 59.18,25.91 J7.P1
N$11
  Top 0.254: IC2.2 65.28,20.57 60.71,20.57 59.69,21.59 59.44,21.59 59.18,21.34 J8.P2
N$12
  Top 0.254: IC2.3 65.28,19.3 60.96,19.3 59.69,18.03 59.18,18.54 J8.P1
N$13
  Top 0.254: J9.P2 59.44,14.22 59.94,14.22 60.96,13.21 65.02,13.21 IC3.2
N$14
  Top 0.254: IC3.3 65.02,11.94 60.71,11.94 59.94,11.18 59.18,11.18 J9.P1
N$15
  Top 0.254: LED8.A 78.23,22.86 80.77,22.86 R8.2
N$16
  Top 0.254: LED9.A 78.23,20.83 80.52,20.83 80.77,20.57 R9.2
N$23
  Top 0.254: LED10.A 77.98,18.29 80.77,18.29 R10.2
PRESSURE1_LED
  Top 0.254: JP9.9 93.22,30.48 92.2,29.46 82.55,29.46 R5.1
PRESSURE2_LED
  Top 0.254: JP9.2 93.47,12.7 88.14,18.03 82.8,18.03 R10.1
SCL  (via drill 0.35, 0.41)
  Top 0.254: v26.16,18.54 56.13,48.51 68.08,48.51 68.1,48.5 69.32,48.5 v69.66,48.84
  Bottom 0.254: v26.16,18.54 7.62,18.54 5.84,16.76 5.33,16.76 J1.3 | v69.66,48.84 84.53,48.84 JP5.8
SDA  (via drill 0.41)
  Top 0.254: v23.88,19.56 25.91,17.53 26.42,17.53 50.29,41.4 50.29,41.91 56.39,48.01 80.9,48.01 JP5.7
  Bottom 0.254: v23.88,19.56 23.11,20.32 6.86,20.32 5.84,19.3 5.33,19.3 J1.2
STATE_LED
  Top 0.254: R6.1 89.15,27.18 93.47,22.86 JP9.6
STATUS_LED
  Top 0.254: JP9.5 93.22,20.32 88.65,24.89 82.8,24.89 R7.1
TEMP1_LED
  Top 0.254: JP9.4 93.47,17.78 88.65,22.61 82.8,22.61 R8.1
TEMP2_LED
  Top 0.254: JP9.3 93.22,15.24 87.88,20.57 82.8,20.57 R9.1
THERMO1_LED
  Top 0.254: JP9.13 93.22,40.64 91.44,38.86 82.55,38.86 R1.1
THERMO2_LED
  Top 0.254: JP9.12 93.47,38.1 91.95,36.58 82.55,36.58 R2.1
THERMO3_LED
  Top 0.254: JP9.11 93.22,35.56 91.95,34.29 82.55,34.29 R3.1
VOUT_PRESSURE_1
  Bottom 0.254: JP7.3 55.88,2.79 54.36,4.32 43.69,4.32 42.42,5.59 26.16,5.59 23.88,7.87 23.37,7.87 J5.2
VOUT_PRESSURE_2  (via drill 0.41)
  Top 0.254: JP7.4 58.42,3.05 v48.51,12.95
  Bottom 0.254: v48.51,12.95 35.95,25.51 11.27,25.51 9.88,26.9 9.88,38.33 9.79,38.42 9.62,38.6 J11.2
VOUT_TEMPERATURE_1
  Bottom 0.254: JP7.5 60.96,2.79 59.04,4.72 58.93,4.83 58.22,5.54 45.74,5.54 42.14,9.14 J2.2
VOUT_TEMPERATURE_2
  Bottom 0.254: JP7.6 63.5,3.05 55.37,11.18 41.15,11.18 39.62,9.65 39.62,9.4 J2.1

### Text on the board
tPlace: 5V | 9 | 8 | 7 | 6 | 5 | 4 | 3 | 2 | 1 | 0 | 22 | 14 | 15 | 16 | 17 | 18 | 19 | 20 | 21 | 13 | 12 | 11 | 10 | GND | 24 | AREF | PWM | TX | RX | 26 | TX3 | RX3 | TX2 | RX2 | TX1 | RX1 | SDA | SCL | COMMUNICATION | 28 | 30 | 31 | 32 | 33 | 34 | 35 | 36 | 37 | 38 | 39 | 40 | 41 | DIGITAL | 42 | 43 | LPRD Sensors Board / Pierre Abillama | 44 | 45 | 2018 REV 1.4 | 46 | 47 | 48 | 49 | 50 | 51 | 52 | 53 | ANALOG IN | 0 | 1 | 2 | 3 | 4 | 5 | 6 | 7 | 8 | 9 | 10 | 11 | 12 | 13 | 14 | 15 | GND | RES | 3V3 | 5V | GND | VIN